# Altium schematic sheet DOC REVISION HISTORY.SchDoc: =title
size A3; DocumentNumber: 9; SheetNumber: 9; SheetTotal: 9
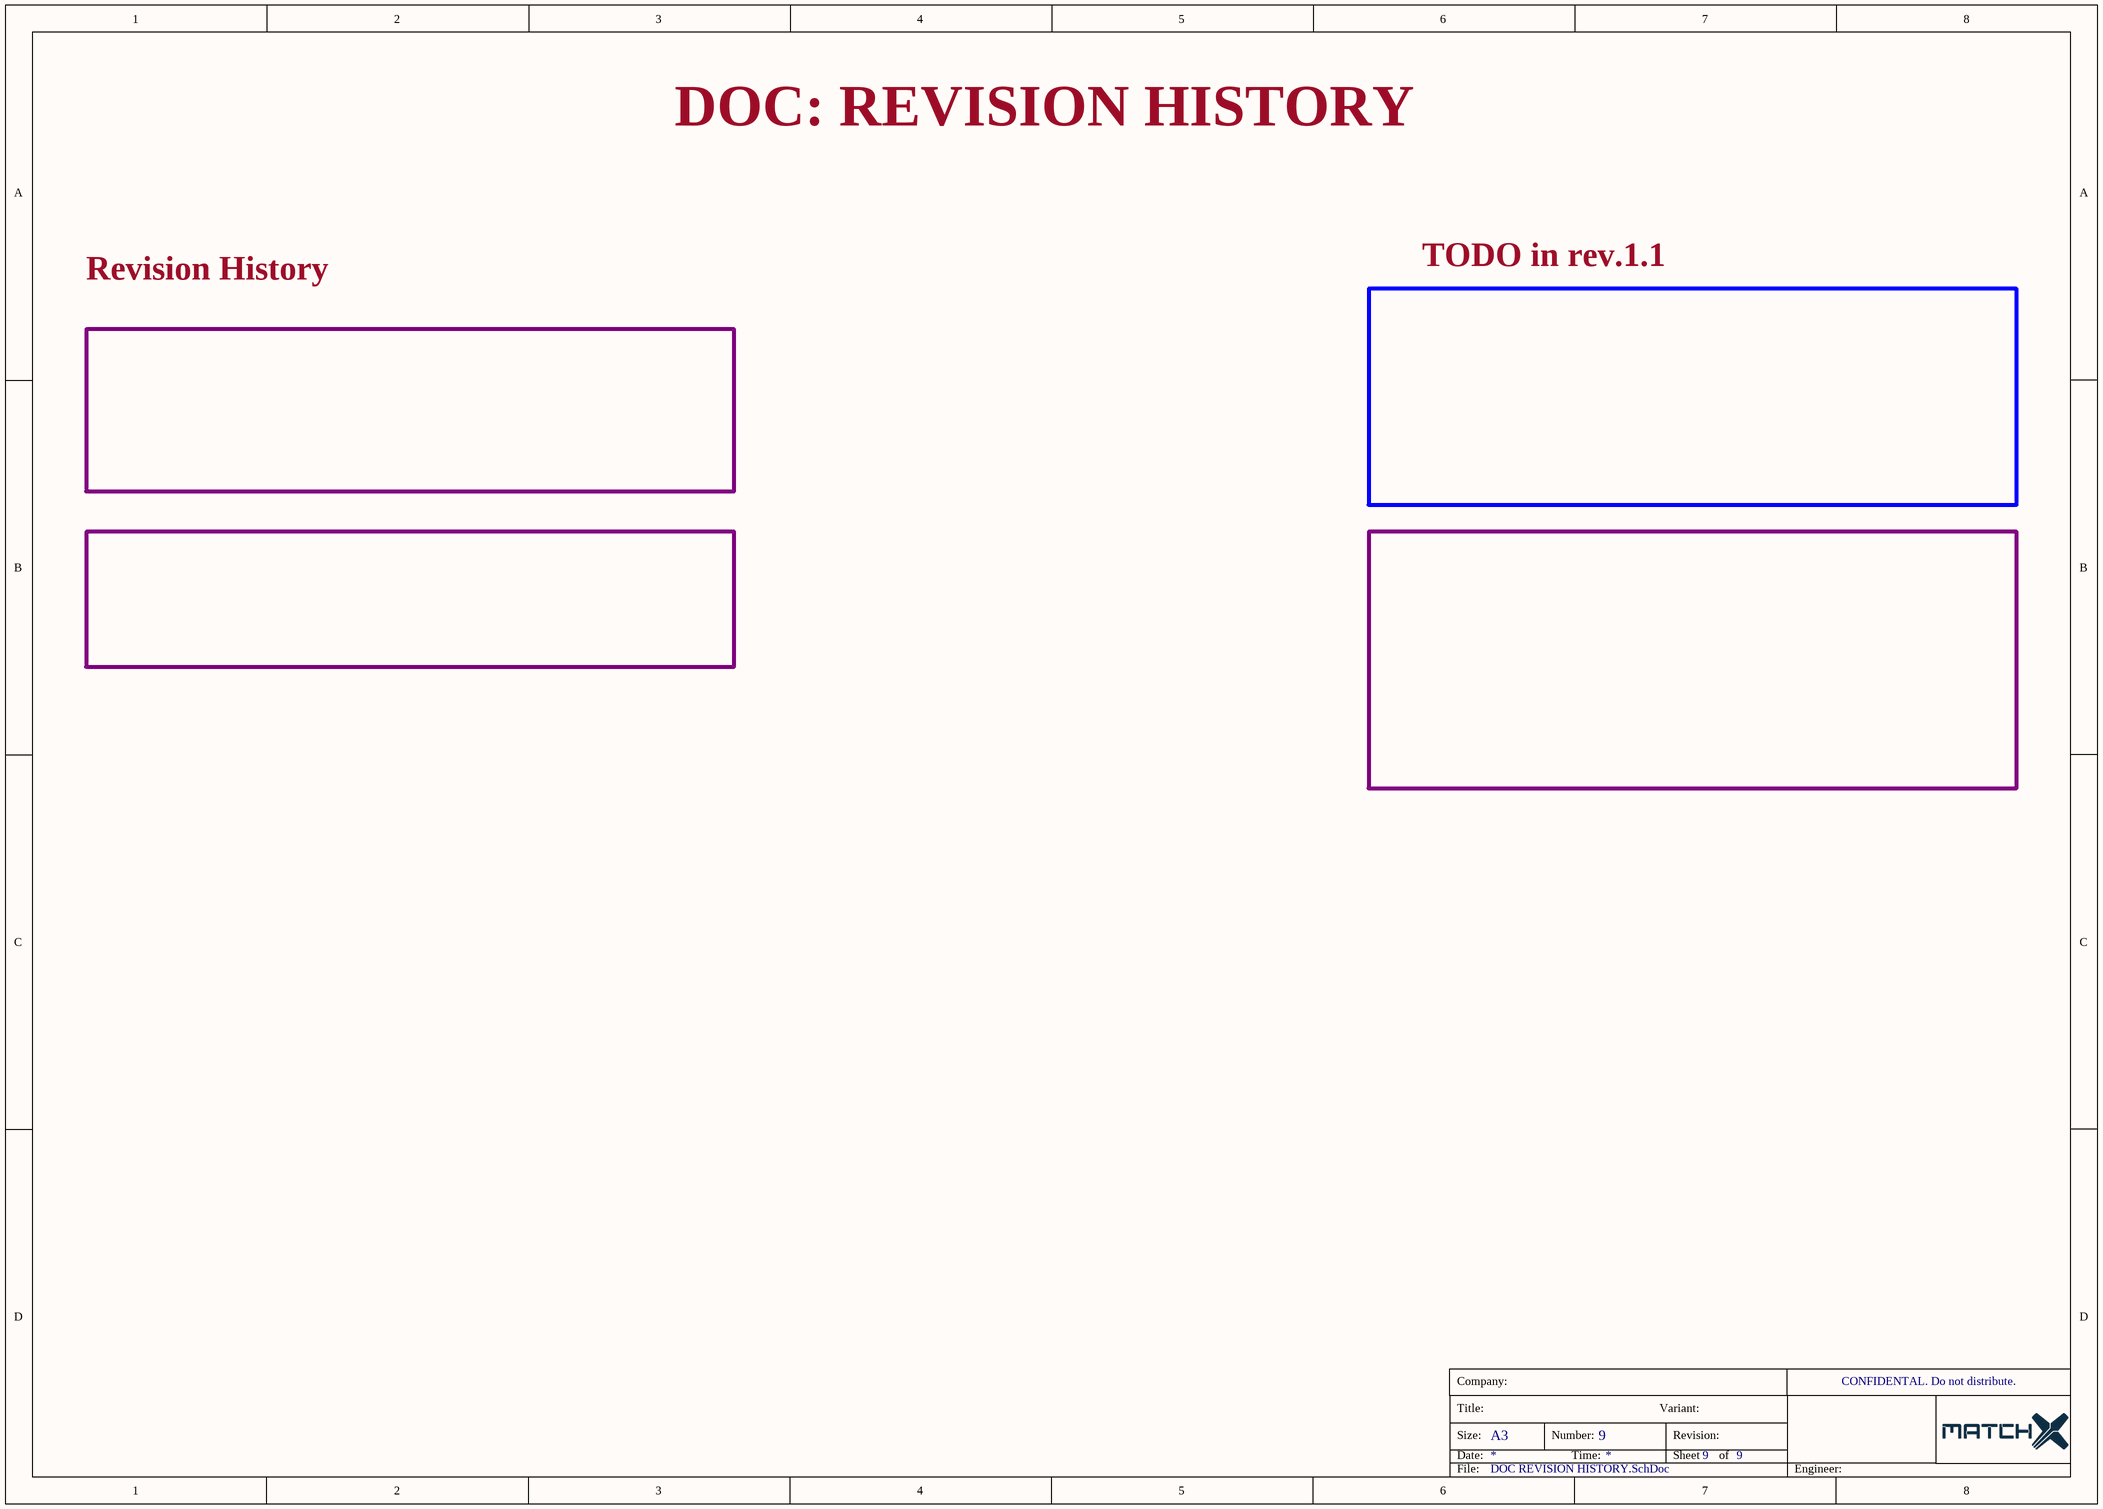
[diagram p0: DOC REVISION HISTORY.SchDoc]

## Notes on the sheet
- DOC: REVISION HISTORY
- Revision History
- TODO in rev.1.1
- CLOCKS (CPU & PCIE)
- Company:
- CONFIDENTAL. Do not distribute.
- Title:
- Size:
- Date:
- A3
- Number:
- Time:
- Variant:
- Revision:
- Sheet
- of
- File:
- Engineer: